# Altium project contador 3 bits.PrjPcb
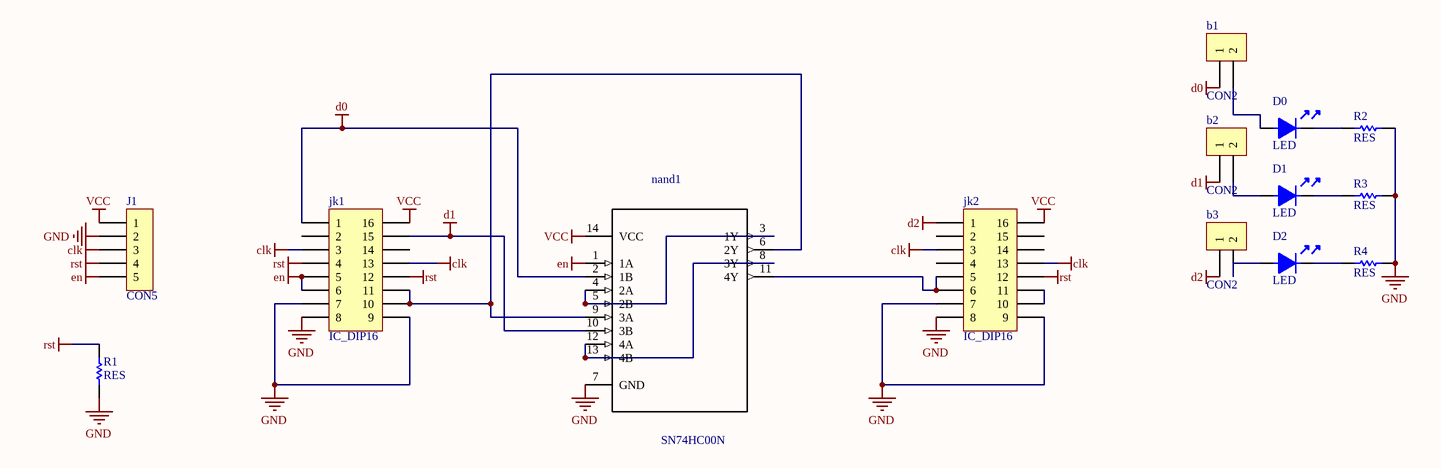
[diagram p0: esquematico.SchDoc]
1 sheet, 14 parts. Net scope: global (net labels, ports and power ports of the same name join across sheets).

## Sheet esquematico.SchDoc
size A4

### Parts
b1  CON2  [SIP2]
b2  CON2  [SIP2]
b3  CON2  [SIP2]
D0  LED  [LED3]
D1  LED  [LED3]
D2  LED  [LED3]
J1  CON5  [SIP5]
jk1  IC_DIP16  [DIP16]
jk2  IC_DIP16  [DIP16]
nand1  SN74HC00N  [DIP254P762X508-14]
R1  RES  [RES400]
R2  RES  [RES400]
R3  RES  [RES400]
R4  RES  [RES400]

### Nets
clk: J1.3 jk1.3 jk1.13 jk2.3 jk2.13
d0: b1.1 jk1.1 nand1.2(1B)
d1: b2.1 jk1.15 nand1.10(3B)
d2: b3.1 jk2.1
en: J1.5 jk1.5 jk1.6 nand1.1(1A)
GND: J1.2 jk1.7 jk1.8 jk1.9 jk2.7 jk2.8 jk2.9 nand1.7(GND) R1.1 R2.2 R3.2 R4.2
rst: J1.4 jk1.4 jk1.12 jk2.12 R1.2
VCC: J1.1 jk1.16 jk2.16 nand1.14(VCC)
Netb1_2: b1.2 D0.1
Netb2_2: b2.2 D1.1
Netb3_2: b3.2 D2.1
NetD0_2: D0.2 R2.1
NetD1_2: D1.2 R3.1
NetD2_2: D2.2 R4.1
Netjk1_10: jk1.10 jk1.11 nand1.6(2Y) nand1.9(3A)
Netjk2_5: jk2.5 jk2.6 nand1.11(4Y)
Netjk2_10: jk2.10 jk2.11
Netnand1_3: nand1.3(1Y) nand1.4(2A) nand1.5(2B)
Netnand1_8: nand1.8(3Y) nand1.12(4A) nand1.13(4B)

Not connected (* = marked no-connect by the designer): jk1 2 14; jk2 2 4 14 15

### Library data of the parts
nand1 = SN74HC00N: NAND Gate 4-Element 2-IN CMOS 14-Pin PDIP NAND Gate 4-Element 2-IN CMOS 14-Pin PDIP NAND Gate 4-Element 2-IN CMOS 14-...; MF: Texas Instruments; Package: DIP-14 Texas Instruments; MP: SN74HC00N; Price: None; SnapEDA_Link: https://www.snapeda.com/parts/SN74HC00N/Texas%20Instruments/view-part/?ref=snap; Availability: Unavailable; Value: *